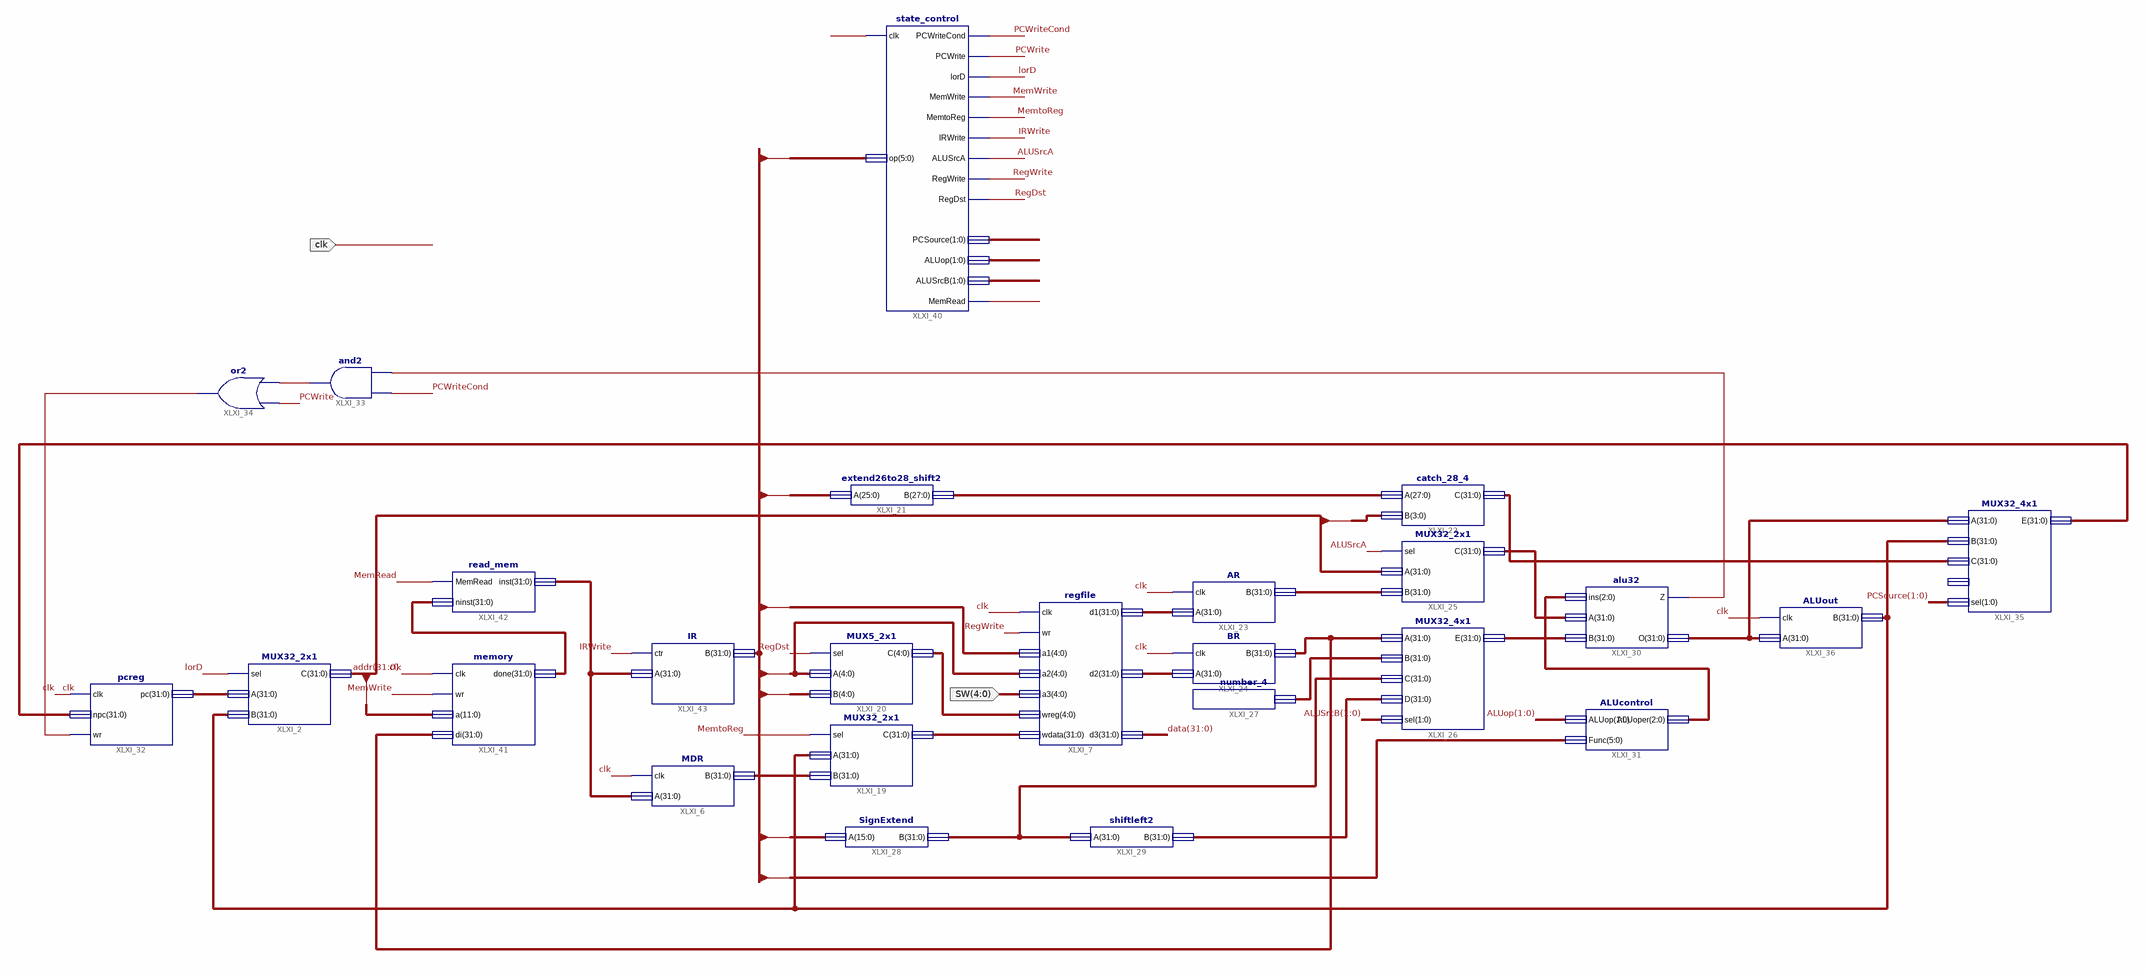
[diagram p0: schematic sheet 1]
// Xilinx ISE schematic top_for_multy_CPU.sch (kintex7) as structural Verilog: 25 symbols, 2 ports
module top_for_multy_CPU (
  input  clk,
  input  [4:0] SW
);

  wire ALUSrcA, IRWrite, lorD, MemRead, MemtoReg, MemWrite, PCWrite, PCWriteCond, RegDst, RegWrite, XLXN_64,
       XLXN_67, XLXN_68;
  wire [1:0] ALUop, ALUSrcB, PCSource;
  wire [2:0] XLXN_59;
  wire [4:0] XLXN_34;
  wire [27:0] XLXN_42;
  wire [31:0] addr, data, instr, XLXN_1, XLXN_31, XLXN_32, XLXN_44, XLXN_45, XLXN_48, XLXN_52, XLXN_55,
       XLXN_56, XLXN_57, XLXN_58, XLXN_69, XLXN_70, XLXN_71, XLXN_76, XLXN_104, XLXN_105, XLXN_107;

  MDR XLXI_6 (.clk(clk), .A(XLXN_107), .B(XLXN_31));
  regfile XLXI_7 (
    .clk(clk), .wr(RegWrite), .a1(instr[25:21]), .a2(instr[20:16]), .a3(SW), .wreg(XLXN_34), .wdata(XLXN_32),
    .d1(XLXN_44), .d2(XLXN_45), .d3(data));
  MUX32_2x1 XLXI_2 (.sel(lorD), .A(XLXN_1), .B(XLXN_71), .C(addr));
  MUX32_2x1 XLXI_19 (.sel(MemtoReg), .A(XLXN_71), .B(XLXN_31), .C(XLXN_32));
  MUX5_2x1 XLXI_20 (.sel(RegDst), .A(instr[20:16]), .B(instr[15:11]), .C(XLXN_34));
  extend26to28_shift2 XLXI_21 (.A(instr[25:0]), .B(XLXN_42));
  catch_28_4 XLXI_22 (.A(XLXN_42), .B(addr[31:28]), .C(XLXN_70));
  AR XLXI_23 (.clk(clk), .A(XLXN_44), .B(XLXN_48));
  BR XLXI_24 (.clk(clk), .A(XLXN_45), .B(XLXN_104));
  MUX32_2x1 XLXI_25 (.sel(ALUSrcA), .A(addr), .B(XLXN_48), .C(XLXN_58));
  MUX32_4x1 XLXI_26 (.A(XLXN_104), .B(XLXN_52), .C(XLXN_55), .D(XLXN_56), .sel(ALUSrcB), .E(XLXN_57));
  number_4 XLXI_27 (.num(XLXN_52));
  SignExtend XLXI_28 (.A(instr[15:0]), .B(XLXN_55));
  shiftleft2 XLXI_29 (.A(XLXN_55), .B(XLXN_56));
  alu32 XLXI_30 (.ins(XLXN_59), .A(XLXN_58), .B(XLXN_57), .Z(XLXN_67), .O(XLXN_69));
  ALUcontrol XLXI_31 (.ALUop(ALUop), .Func(instr[5:0]), .ALUoper(XLXN_59));
  pcreg XLXI_32 (.clk(clk), .npc(XLXN_76), .pc(XLXN_1), .wr(XLXN_68));
  and XLXI_33 (XLXN_64, XLXN_67, PCWriteCond);
  or XLXI_34 (XLXN_68, XLXN_64, PCWrite);
  MUX32_4x1 XLXI_35 (.A(XLXN_69), .B(XLXN_71), .C(XLXN_70), .sel(PCSource), .E(XLXN_76));  // open: D
  ALUout XLXI_36 (.clk(clk), .A(XLXN_69), .B(XLXN_71));
  state_control XLXI_40 (
    .clk(clk), .op(instr[31:26]), .PCWriteCond(PCWriteCond), .PCWrite(PCWrite), .lorD(lorD),
    .MemWrite(MemWrite), .MemtoReg(MemtoReg), .IRWrite(IRWrite), .ALUSrcA(ALUSrcA), .RegWrite(RegWrite),
    .RegDst(RegDst), .PCSource(PCSource), .ALUop(ALUop), .ALUSrcB(ALUSrcB), .MemRead(MemRead));
  memory XLXI_41 (.clk(clk), .wr(MemWrite), .a(addr[11:0]), .di(XLXN_104), .done(XLXN_105));
  read_mem XLXI_42 (.MemRead(MemRead), .ninst(XLXN_105), .inst(XLXN_107));
  IR XLXI_43 (.ctr(IRWrite), .A(XLXN_107), .B(instr));
endmodule
